# Altium schematic sheet AVR64DA64-BREAKOUT.SchDoc
size A2; SheetNumber: 1; SheetTotal: 3
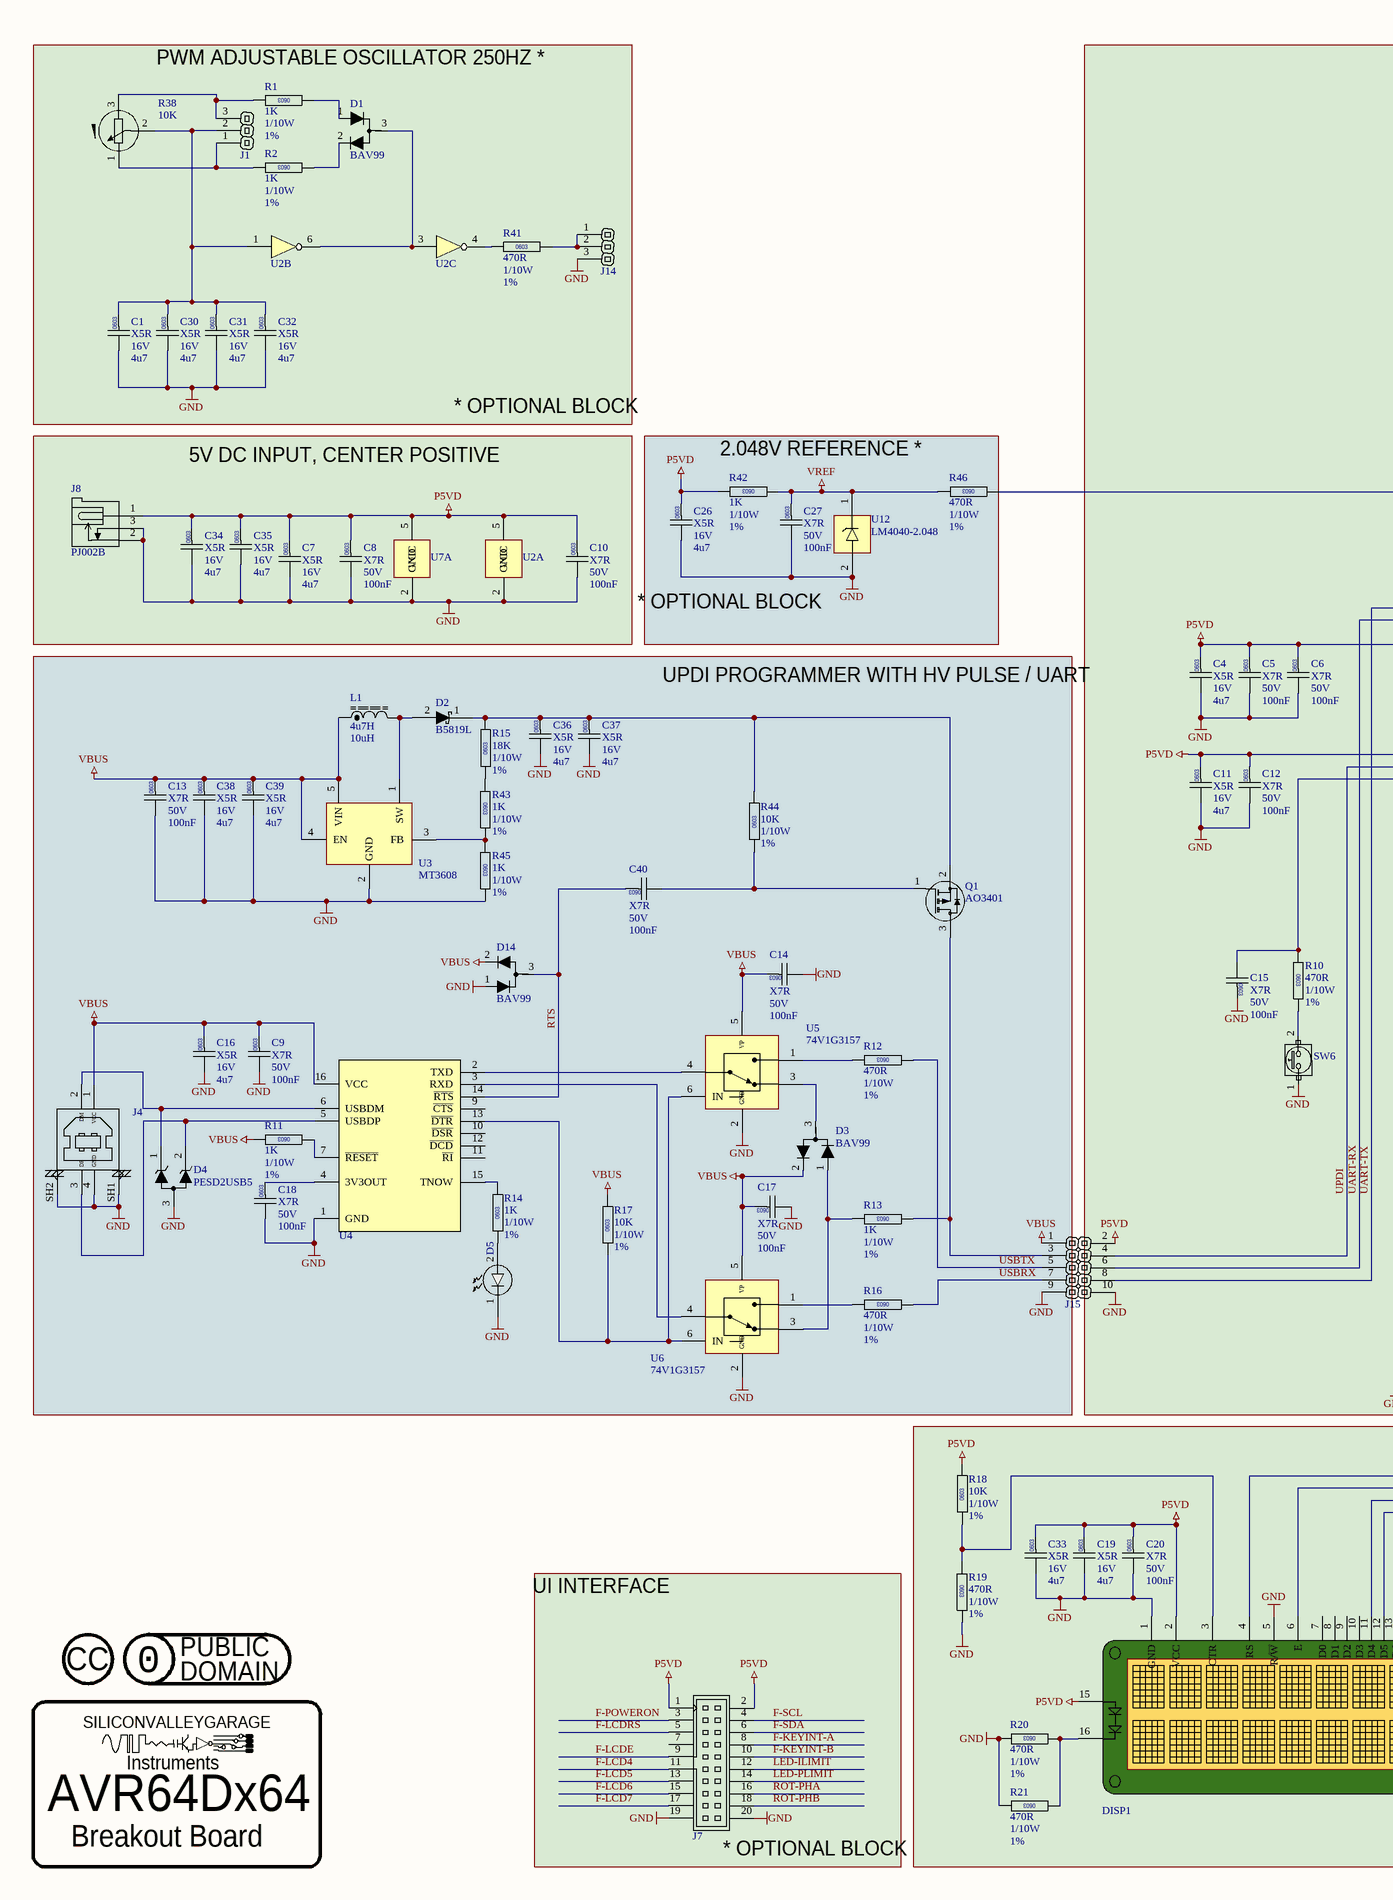
[diagram p0: AVR64DA64-BREAKOUT.SchDoc, left]
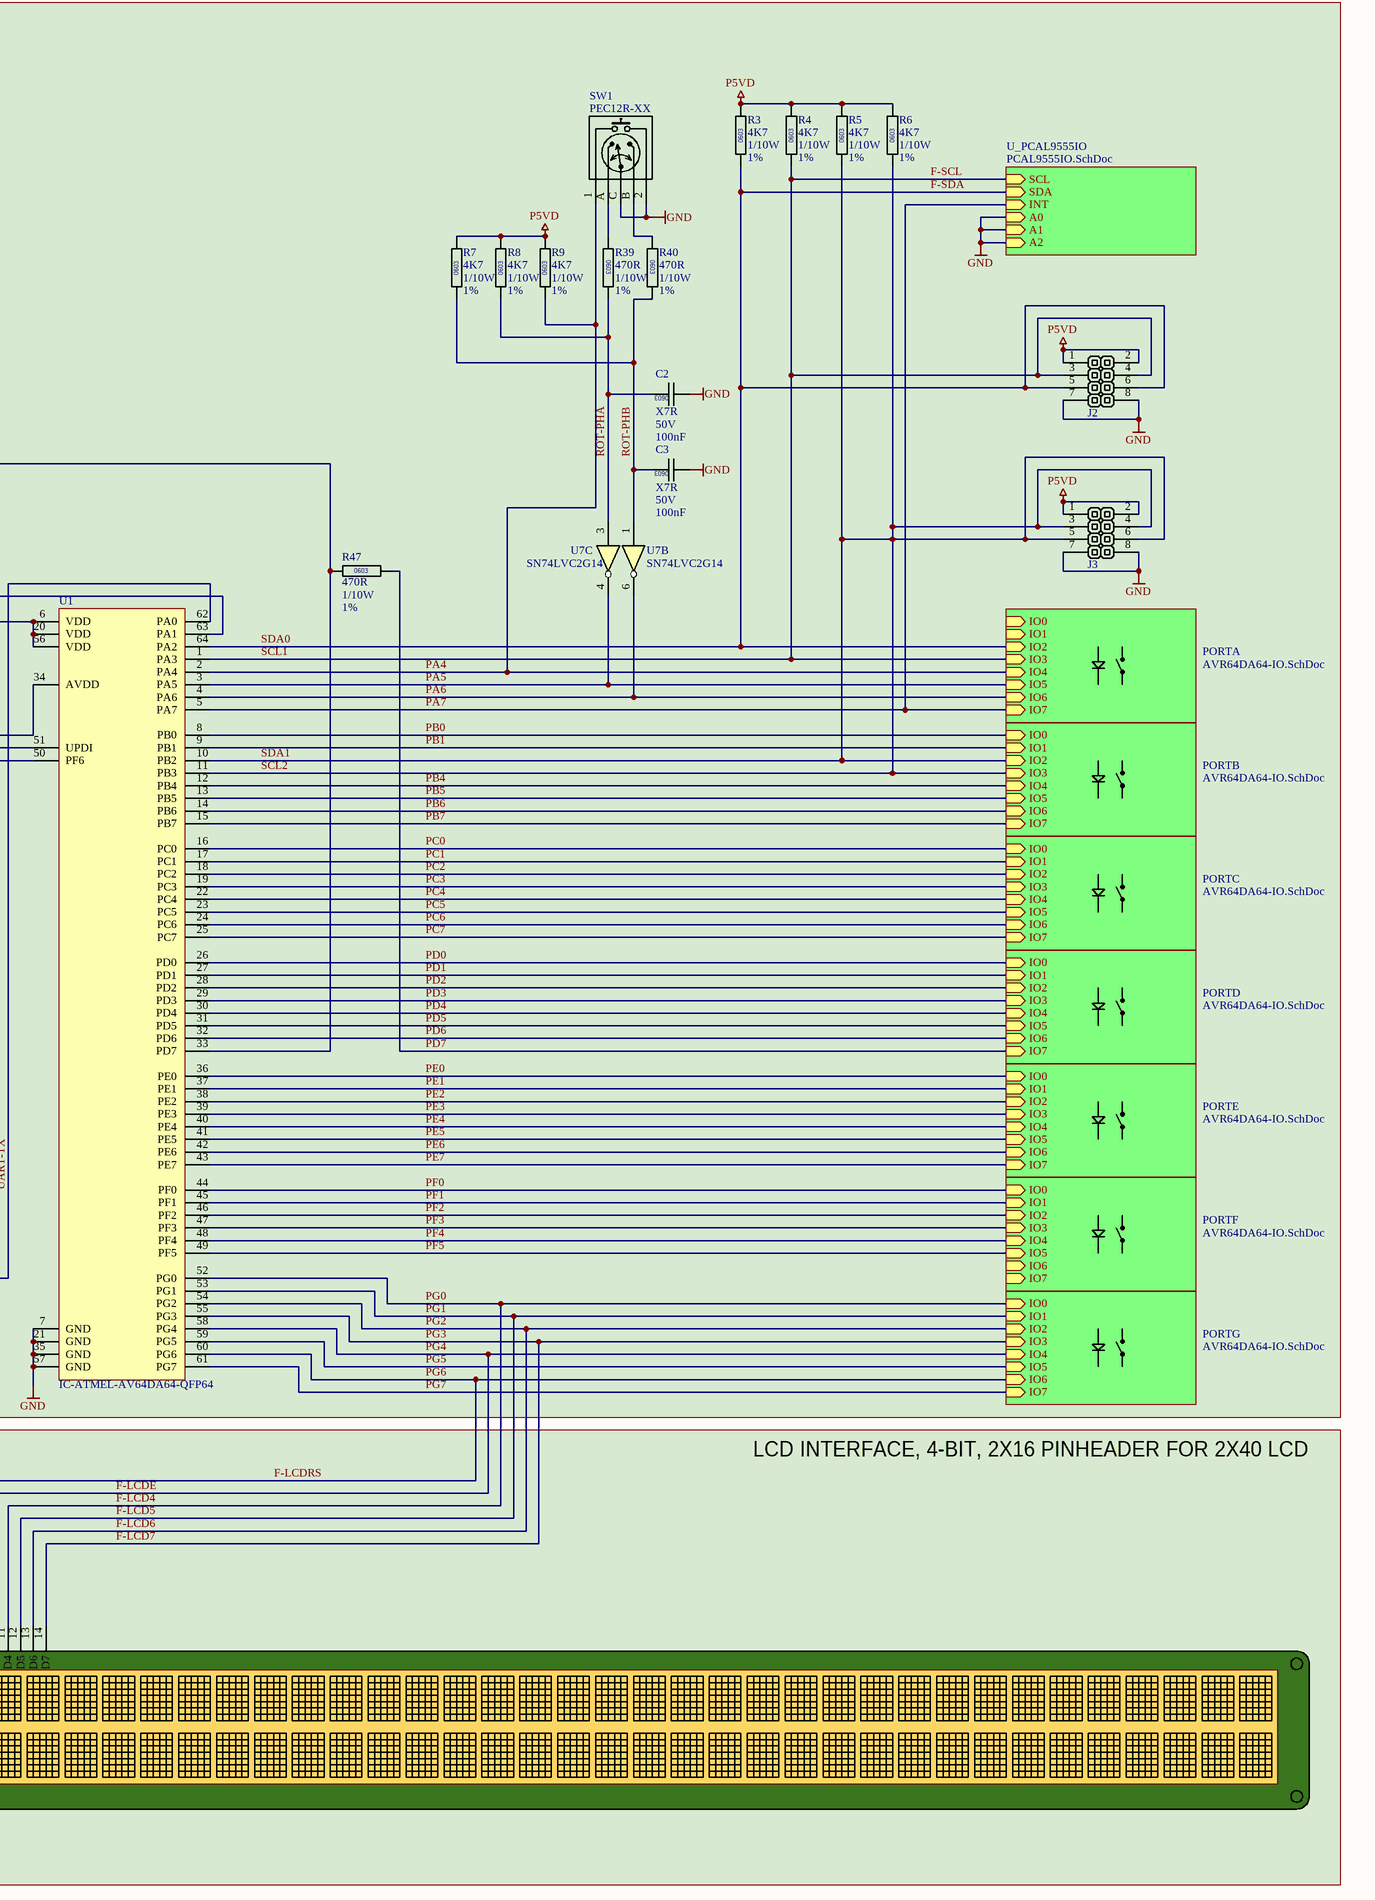
[diagram p1: AVR64DA64-BREAKOUT.SchDoc, right]

## Parts
(Parts that share a designator on the sheet are numbered #1, #2 ... from top to bottom, then left to right.)
C1  Dielectric: X5R  Voltage: 16V  Capacitance: 4u7  [CAPC0603]  (hidden comment: CAP0603)
C2  Dielectric: X7R  Voltage: 50V  Capacitance: 100nF  [CAPC0603]  (hidden comment: CAP0603)
C3  Dielectric: X7R  Voltage: 50V  Capacitance: 100nF  [CAPC0603]  (hidden comment: CAP0603)
C4  Dielectric: X5R  Voltage: 16V  Capacitance: 4u7  [CAPC0603]  (hidden comment: CAP0603)
C5  Dielectric: X7R  Voltage: 50V  Capacitance: 100nF  [CAPC0603]  (hidden comment: CAP0603)
C6  Dielectric: X7R  Voltage: 50V  Capacitance: 100nF  [CAPC0603]  (hidden comment: CAP0603)
C7  Dielectric: X5R  Voltage: 16V  Capacitance: 4u7  [CAPC0603]  (hidden comment: CAP0603)
C8  Dielectric: X7R  Voltage: 50V  Capacitance: 100nF  [CAPC0603]  (hidden comment: CAP0603)
C9  Dielectric: X7R  Voltage: 50V  Capacitance: 100nF  [CAPC0603]  (hidden comment: CAP0603)
C10  Dielectric: X7R  Voltage: 50V  Capacitance: 100nF  [CAPC0603]  (hidden comment: CAP0603)
C11  Dielectric: X5R  Voltage: 16V  Capacitance: 4u7  [CAPC0603]  (hidden comment: CAP0603)
C12  Dielectric: X7R  Voltage: 50V  Capacitance: 100nF  [CAPC0603]  (hidden comment: CAP0603)
C13  Dielectric: X7R  Voltage: 50V  Capacitance: 100nF  [CAPC0603]  (hidden comment: CAP0603)
C14  Dielectric: X7R  Voltage: 50V  Capacitance: 100nF  [CAPC0603]  (hidden comment: CAP0603)
C15  Dielectric: X7R  Voltage: 50V  Capacitance: 100nF  [CAPC0603]  (hidden comment: CAP0603)
C16  Dielectric: X5R  Voltage: 16V  Capacitance: 4u7  [CAPC0603]  (hidden comment: CAP0603)
C17  Dielectric: X7R  Voltage: 50V  Capacitance: 100nF  [CAPC0603]  (hidden comment: CAP0603)
C18  Dielectric: X7R  Voltage: 50V  Capacitance: 100nF  [CAPC0603]  (hidden comment: CAP0603)
C19  Dielectric: X5R  Voltage: 16V  Capacitance: 4u7  [CAPC0603]  (hidden comment: CAP0603)
C20  Dielectric: X7R  Voltage: 50V  Capacitance: 100nF  [CAPC0603]  (hidden comment: CAP0603)
C26  Dielectric: X5R  Voltage: 16V  Capacitance: 4u7  [CAPC0603]  (hidden comment: CAP0603)
C27  Dielectric: X7R  Voltage: 50V  Capacitance: 100nF  [CAPC0603]  (hidden comment: CAP0603)
C30  Dielectric: X5R  Voltage: 16V  Capacitance: 4u7  [CAPC0603]  (hidden comment: CAP0603)
C31  Dielectric: X5R  Voltage: 16V  Capacitance: 4u7  [CAPC0603]  (hidden comment: CAP0603)
C32  Dielectric: X5R  Voltage: 16V  Capacitance: 4u7  [CAPC0603]  (hidden comment: CAP0603)
C33  Dielectric: X5R  Voltage: 16V  Capacitance: 4u7  [CAPC0603]  (hidden comment: CAP0603)
C34  Dielectric: X5R  Voltage: 16V  Capacitance: 4u7  [CAPC0603]  (hidden comment: CAP0603)
C35  Dielectric: X5R  Voltage: 16V  Capacitance: 4u7  [CAPC0603]  (hidden comment: CAP0603)
C36  Dielectric: X5R  Voltage: 16V  Capacitance: 4u7  [CAPC0603]  (hidden comment: CAP0603)
C37  Dielectric: X5R  Voltage: 16V  Capacitance: 4u7  [CAPC0603]  (hidden comment: CAP0603)
C38  Dielectric: X5R  Voltage: 16V  Capacitance: 4u7  [CAPC0603]  (hidden comment: CAP0603)
C39  Dielectric: X5R  Voltage: 16V  Capacitance: 4u7  [CAPC0603]  (hidden comment: CAP0603)
C40  Dielectric: X7R  Voltage: 50V  Capacitance: 100nF  [CAPC0603]  (hidden comment: CAP0603)
D1  BAV99  [SOT23]
D2  B5819L  [SOD123]
D3  BAV99  [SOT23]
D4  PESD2USB5  [SOT23]
D5  KT-0603W  [LED-0603-GREEN]  (value not drawn)
D14  BAV99  [SOT23]
DISP1  DISPLAY-LCD-2X40  [CONNECTOR-GENERIC-BOXHEADER-2X8]  (value not drawn)
J1  BOXHEADER-2X4  [HEADER-GENERIC-MALE-1X3]  (value not drawn)
J2  BOXHEADER-2X4  [CONNECTOR-GENERIC-PINHEADER-2X4]  (value not drawn)
J3  BOXHEADER-2X4  [CONNECTOR-GENERIC-PINHEADER-2X4]  (value not drawn)
J4  CONN-CUI-UJ2-BH-BL1-TH  [CONN-CUI-UJ2-BH-BL1-TH]  (value not drawn)
J7  BOXHEADER-10X2  [CONNECTOR GENERIC-BOXHEADER-2X10]  (value not drawn)
J8  PJ002B  [CONN-CUI-PJ-002B]
J14  BOXHEADER-2X4  [HEADER-GENERIC-MALE-1X3]  (value not drawn)
J15  BOXHEADER-3X2  [CONNECTOR-GENERIC-PINHEADER-2X5]  (value not drawn)
L1  10uH  value 4u7H  [CAPC0603]
LOGO?#1  LOGO-LICENSE-CC  [LOGO-LICENSE-CC]  (value not drawn)  (no BOM)
LOGO?#2  LOGO-LICENSE-CC0-PUBLIC  [LOGO-LICENSE-CC0-PUBLIC]  (value not drawn)  (no BOM)
LOGO?#3  LOGO-SILICONVALLEYGARAGE-SMALL  [SILICONVALLEYGARAGE]  (value not drawn)  (graphical)
Q1  AO3401  [SOT23]
R1  value 1K  Power: 1/10W  Tolerance: 1%  [RESC0603]  (hidden comment: RESC0603)
R2  value 1K  Power: 1/10W  Tolerance: 1%  [RESC0603]  (hidden comment: RESC0603)
R3  value 4K7  Power: 1/10W  Tolerance: 1%  [RESC0603]  (hidden comment: RESC0603)
R4  value 4K7  Power: 1/10W  Tolerance: 1%  [RESC0603]  (hidden comment: RESC0603)
R5  value 4K7  Power: 1/10W  Tolerance: 1%  [RESC0603]  (hidden comment: RESC0603)
R6  value 4K7  Power: 1/10W  Tolerance: 1%  [RESC0603]  (hidden comment: RESC0603)
R7  value 4K7  Power: 1/10W  Tolerance: 1%  [RESC0603]  (hidden comment: RESC0603)
R8  value 4K7  Power: 1/10W  Tolerance: 1%  [RESC0603]  (hidden comment: RESC0603)
R9  value 4K7  Power: 1/10W  Tolerance: 1%  [RESC0603]  (hidden comment: RESC0603)
R10  value 470R  Power: 1/10W  Tolerance: 1%  [RESC0603]  (hidden comment: RESC0603)
R11  value 1K  Power: 1/10W  Tolerance: 1%  [RESC0603]  (hidden comment: RESC0603)
R12  value 470R  Power: 1/10W  Tolerance: 1%  [RESC0603]  (hidden comment: RESC0603)
R13  value 1K  Power: 1/10W  Tolerance: 1%  [RESC0603]  (hidden comment: RESC0603)
R14  value 1K  Power: 1/10W  Tolerance: 1%  [RESC0603]  (hidden comment: RESC0603)
R15  value 18K  Power: 1/10W  Tolerance: 1%  [RESC0603]  (hidden comment: RESC0603)
R16  value 470R  Power: 1/10W  Tolerance: 1%  [RESC0603]  (hidden comment: RESC0603)
R17  value 10K  Power: 1/10W  Tolerance: 1%  [RESC0603]  (hidden comment: RESC0603)
R18  value 10K  Power: 1/10W  Tolerance: 1%  [RESC0603]  (hidden comment: RESC0603)
R19  value 470R  Power: 1/10W  Tolerance: 1%  [RESC0603]  (hidden comment: RESC0603)
R20  value 470R  Power: 1/10W  Tolerance: 1%  [RESC0603]  (hidden comment: RESC0603)
R21  value 470R  Power: 1/10W  Tolerance: 1%  [RESC0603]  (hidden comment: RESC0603)
R38  value 10K  [POTMETER-PTV09A-4015F-BXXX]  (hidden comment: POTMETER-PTV09A-4015F-B103)
R39  value 470R  Power: 1/10W  Tolerance: 1%  [RESC0603]  (hidden comment: RESC0603)
R40  value 470R  Power: 1/10W  Tolerance: 1%  [RESC0603]  (hidden comment: RESC0603)
R41  value 470R  Power: 1/10W  Tolerance: 1%  [RESC0603]  (hidden comment: RESC0603)
R42  value 1K  Power: 1/10W  Tolerance: 1%  [RESC0603]  (hidden comment: RESC0603)
R43  value 1K  Power: 1/10W  Tolerance: 1%  [RESC0603]  (hidden comment: RESC0603)
R44  value 10K  Power: 1/10W  Tolerance: 1%  [RESC0603]  (hidden comment: RESC0603)
R45  value 1K  Power: 1/10W  Tolerance: 1%  [RESC0603]  (hidden comment: RESC0603)
R46  value 470R  Power: 1/10W  Tolerance: 1%  [RESC0603]  (hidden comment: RESC0603)
R47  value 470R  Power: 1/10W  Tolerance: 1%  [RESC0603]  (hidden comment: RESC0603)
SW1  PEC12R-XX  [SWITCH-BOURNS-PEC12R-4120F-S0012]
SW6  SWITCH-XUNPU-TS-1088-AR02016  [SWITCH-XUNPU-TS-1088-AR02016]  (value not drawn)
U1  IC-ATMEL-AV64DA64-QFP64  [QFP50P1000X1000X100-64N]
U2  IC-TI-SN74LVC2G14  [SOT23-6]  (value not drawn)  (parts A,B,C of 3)
U3  MT3608  [SOT23-6]
U4  CP2102  [SO127P600-16N]  (value not drawn)
U5  74V1G3157  [SOT23-6]
U6  74V1G3157  [SOT23-6]
U7  IC-TI-SN74LVC2G14  [SOT23-6]  (value not drawn)  (parts A,B,C of 3)
U12  LM4040-2.048  [SOT23]

## Blocks framed on the sheet
5V DC INPUT, CENTER POSITIVE: C7 C8 C10 C34 C35 J8 U2 U7
UPDI PROGRAMMER WITH HV PULSE / UART: C9 C13 C14 C16-C18 C36-C40 D2-D5 D14 J4 L1 Q1 R11-R17 R43-R45 U3-U6
LCD INTERFACE, 4-BIT, 2X16 PINHEADER FOR 2X40 LCD: C19 C20 C33 DISP1 R18-R21
AVR64Dx64: LOGO?#3

## Sub-sheets
PORTA = AVR64DA64-IO.SchDoc: IO0 (in), IO1 (in), IO2 (in), IO3 (in), IO4 (in), IO5 (in), IO6 (in), IO7 (in)
PORTB = AVR64DA64-IO.SchDoc: IO0 (in), IO1 (in), IO2 (in), IO3 (in), IO4 (in), IO5 (in), IO6 (in), IO7 (in)
PORTC = AVR64DA64-IO.SchDoc: IO0 (in), IO1 (in), IO2 (in), IO3 (in), IO4 (in), IO5 (in), IO6 (in), IO7 (in)
PORTD = AVR64DA64-IO.SchDoc: IO0 (in), IO1 (in), IO2 (in), IO3 (in), IO4 (in), IO5 (in), IO6 (in), IO7 (in)
PORTE = AVR64DA64-IO.SchDoc: IO0 (in), IO1 (in), IO2 (in), IO3 (in), IO4 (in), IO5 (in), IO6 (in), IO7 (in)
PORTF = AVR64DA64-IO.SchDoc: IO0 (in), IO1 (in), IO2 (in), IO3 (in), IO4 (in), IO5 (in), IO6 (in), IO7 (in)
PORTG = AVR64DA64-IO.SchDoc: IO0 (in), IO1 (in), IO2 (in), IO3 (in), IO4 (in), IO5 (in), IO6 (in), IO7 (in)
U_PCAL9555IO = PCAL9555IO.SchDoc: SCL (in), SDA (in), INT (in), A0 (in), A1 (in), A2 (in)

## Nets
GND: C1.2 C2.2 C3.2 C4.2 C5.2 C6.2 C7.2 C8.2 C9.2 C10.2 C11.2 C12.2 C13.2 C14.2 C15.1 C16.2 C17.2 C18.2 C19.2 C20.2 C26.2 C27.2 C30.2 C31.2 C32.2 C33.2 C34.2 C35.2 C36.2 C37.2 C38.2 C39.2 D4.3(A) D5.1(A) D14.1(K) DISP1.1(GND) DISP1.5(R/~{W}) J2.7(-) J2.8(-) J3.7(-) J3.8(-) J4.4(GND) J4.SH1(NO) J4.SH2(NO) J7.19(-) J7.20(-) J8.2 J8.3 J14.3(-) J15.9(-) J15.10(-) R19.1 R20.1 R21.1 R45.1 SW1.2 SW1.C SW6.1 U1.7(GND) U1.21(GND) U1.35(GND) U1.57(GND) U2.2(GND) U3.2(GND) U4.1(GND) U5.2(GND) U6.2(GND) U7.2(GND) U12.2 ; sheet U_PCAL9555IO/A0, sheet U_PCAL9555IO/A1, sheet U_PCAL9555IO/A2
P5VD: C4.1 C5.1 C6.1 C7.1 C8.1 C10.1 C11.1 C12.1 C19.1 C20.1 C26.1 C33.1 C34.1 C35.1 DISP1.2(VCC) DISP1.15(LED+) J2.1(+) J2.2(-) J3.1(+) J3.2(-) J7.1(+) J7.2(-) J8.1 J15.2(-) R3.1 R4.1 R5.1 R6.1 R7.1 R8.1 R9.1 R18.1 R42.1 U1.6(VDD) U1.20(VDD) U1.34(AVDD) U1.56(VDD) U2.5(VCC) U7.5(VCC)
VBUS: C9.1 C13.1 C14.1 C16.1 C17.1 C38.1 C39.1 D3.2(A) D14.2(A) J4.1(VCC) J15.1(+) L1.1 R11.1 R17.1 U3.4(EN) U3.5(VIN) U4.16(VCC) U5.5(VP) U6.5(VP)
VREF: C27.1 R42.2 R46.1 U12.1
F-KEYINT-A: J7.8(-)
F-KEYINT-B: J7.10(-)
F-LCD4: DISP1.11(D4) J7.11(-) U1.52(PG0) ; sheet PORTG/IO0  [also labelled PG0]
F-LCD5: DISP1.12(D5) J7.13(-) U1.53(PG1) ; sheet PORTG/IO1  [also labelled PG1]
F-LCD6: DISP1.13(D6) J7.15(-) U1.54(PG2) ; sheet PORTG/IO2  [also labelled PG2]
F-LCD7: DISP1.14(D7) J7.17(-) U1.55(PG3) ; sheet PORTG/IO3  [also labelled PG3]
F-LCDE: DISP1.6(E) J7.9(-) U1.58(PG4) ; sheet PORTG/IO4  [also labelled PG4]
F-LCDRS: DISP1.4(RS) J7.5(-) U1.60(PG6) ; sheet PORTG/IO6  [also labelled PG6]
F-POWERON: J7.3(-)
F-SCL: J2.3(-) J2.4(-) J7.4(-) R4.2 U1.1(PA3) ; sheet PORTA/IO3, sheet U_PCAL9555IO/SCL  [also labelled SCL1]
F-SDA: J2.5(-) J2.6(-) J7.6(-) R3.2 U1.64(PA2) ; sheet PORTA/IO2, sheet U_PCAL9555IO/SDA  [also labelled SDA0]
LED-ILIMIT: J7.12(-)
LED-PLIMIT: J7.14(-)
PA4: R9.2 SW1.1 U1.2(PA4) ; sheet PORTA/IO4
PA5: U1.3(PA5) U7.4 ; sheet PORTA/IO5
PA6: U1.4(PA6) U7.6 ; sheet PORTA/IO6
PA7: U1.5(PA7) ; sheet PORTA/IO7, sheet U_PCAL9555IO/INT
PB0: U1.8(PB0) ; sheet PORTB/IO0
PB1: U1.9(PB1) ; sheet PORTB/IO1
PB4: U1.12(PB4) ; sheet PORTB/IO4
PB5: U1.13(PB5) ; sheet PORTB/IO5
PB6: U1.14(PB6) ; sheet PORTB/IO6
PB7: U1.15(PB7) ; sheet PORTB/IO7
PC0: U1.16(PC0) ; sheet PORTC/IO0
PC1: U1.17(PC1) ; sheet PORTC/IO1
PC2: U1.18(PC2) ; sheet PORTC/IO2
PC3: U1.19(PC3) ; sheet PORTC/IO3
PC4: U1.22(PC4) ; sheet PORTC/IO4
PC5: U1.23(PC5) ; sheet PORTC/IO5
PC6: U1.24(PC6) ; sheet PORTC/IO6
PC7: U1.25(PC7) ; sheet PORTC/IO7
PD0: U1.26(PD0) ; sheet PORTD/IO0
PD1: U1.27(PD1) ; sheet PORTD/IO1
PD2: U1.28(PD2) ; sheet PORTD/IO2
PD3: U1.29(PD3) ; sheet PORTD/IO3
PD4: U1.30(PD4) ; sheet PORTD/IO4
PD5: U1.31(PD5) ; sheet PORTD/IO5
PD6: U1.32(PD6) ; sheet PORTD/IO6
PD7: R47.1 ; sheet PORTD/IO7
PE0: U1.36(PE0) ; sheet PORTE/IO0
PE1: U1.37(PE1) ; sheet PORTE/IO1
PE2: U1.38(PE2) ; sheet PORTE/IO2
PE3: U1.39(PE3) ; sheet PORTE/IO3
PE4: U1.40(PE4) ; sheet PORTE/IO4
PE5: U1.41(PE5) ; sheet PORTE/IO5
PE6: U1.42(PE6) ; sheet PORTE/IO6
PE7: U1.43(PE7) ; sheet PORTE/IO7
PF0: U1.44(PF0) ; sheet PORTF/IO0
PF1: U1.45(PF1) ; sheet PORTF/IO1
PF2: U1.46(PF2) ; sheet PORTF/IO2
PF3: U1.47(PF3) ; sheet PORTF/IO3
PF4: U1.48(PF4) ; sheet PORTF/IO4
PF5: U1.49(PF5) ; sheet PORTF/IO5
PG5: U1.59(PG5) ; sheet PORTG/IO5
PG7: U1.61(PG7) ; sheet PORTG/IO7
ROT-PHA: C2.1 J7.16(-) R8.2 R39.1 U7.3
ROT-PHB: C3.1 J7.18(-) R7.2 R40.1 U7.1
RTS: C40.1 D14.3(A) U4.14(~{RTS})
SCL2: J3.3(-) J3.4(-) J3.5(-) J3.6(-) R5.2 R6.2 U1.10(PB2) U1.11(PB3) ; sheet PORTB/IO2, sheet PORTB/IO3  [also labelled SDA1]
UART-RX: J15.6(-) U1.63(PA1)
UART-TX: J15.8(-) U1.62(PA0)
UPDI: J15.4(-) U1.51(UPDI)
USBRX: J15.7(-) R16.2
USBTX: J15.5(-) R12.2
NetC1_1: C1.1 C30.1 C31.1 C32.1 J1.2(-) R38.2 U2.1
NetC15_2: C15.2 R10.2 U1.50(PF6)
NetC18_1: C18.1 U4.4(3V3OUT)
NetC36_1: C36.1 C37.1 D2.1(A) Q1.2(S) R15.1 R44.1
NetC40_2: C40.2 Q1.1(G1) R44.2
NetD1_1: D1.1(K) R1.2
NetD1_2: D1.2(A) R2.2
NetD1_3: D1.3(A) U2.3 U2.6
NetD2_2: D2.2(K) L1.2 U3.1(SW)
NetD3_1: D3.1(K) R13.1 U6.3(B1)
NetD3_3: D3.3(A) U5.3(B1)
NetD4_1: D4.1(K) J4.2(DM) U4.6(USBDM)
NetD4_2: D4.2(A) J4.3(DP) U4.5(USBDP)
NetD5_2: D5.2(K) R14.2
NetDISP1_3: DISP1.3(CTR) R18.2 R19.2
NetDISP1_16: DISP1.16(LED-) R20.2 R21.2
NetJ1_1: J1.1(+) R2.1 R38.1
NetJ1_3: J1.3(-) R1.1 R38.3
NetJ14_1: J14.1(+) J14.2(-) R41.1
NetJ15_3: J15.3(-) Q1.3(D) R13.2
NetR10_1: R10.1 SW6.2
NetR11_2: R11.2 U4.7(~{RESET})
NetR12_1: R12.1 U5.1(NO)
NetR14_1: R14.1 U4.15(TNOW)
NetR15_2: R15.2 R43.2
NetR16_1: R16.1 U6.1(NO)
NetR17_2: R17.2 U4.13(~{DTR}) U5.6(IN) U6.6(IN)
NetR39_2: R39.2 SW1.A
NetR40_2: R40.2 SW1.B
NetR41_2: R41.2 U2.4
NetR43_1: R43.1 R45.2 U3.3(FB)
NetR46_2: R46.2 R47.2 U1.33(PD7)
NetU4_2: U4.2(TXD) U5.4(COM)
NetU4_3: U4.3(RXD) U6.4(COM)

Not connected (* = marked no-connect by the designer): DISP1 7(D0) 8(D1) 9(D2) 10(D3); J7 7(-); U4 9(~{CTS}) 10(~{DSR}) 11(~{RI}) 12(~{DCD})

## Notes on the sheet
- PWM ADJUSTABLE OSCILLATOR 250HZ *
- * OPTIONAL BLOCK
- 2.048V REFERENCE *
- UI INTERFACE
- (near LOGO?#3) Instruments
- Breakout Board
- (near J7) * OPTIONAL BLOCK
- (in symbol LOGO-LICENSE-CC) CC
- (in symbol LOGO-LICENSE-CC0-PUBLIC) PUBLIC; 0; DOMAIN
- (in symbol LOGO-SILICONVALLEYGARAGE-SMALL) SILICONVALLEYGARAGE
- (in symbol RESC-0603-1K-1%-1/10W) 0603
- (in symbol RESC-0603-4K7-1%-1/10W) 0603
- (in symbol RESC-0603-10K-1%-1/10W) 0603
- (in symbol RESC-0603-18K-1%-1/10W) 0603
- (in symbol RESC-0603-470R-1%-1/10W) 0603

## Library data of the parts
C1 C4 C7 C11 C16 C19 C26 C30-C39 = CAPC-0603-4u7-10V-X5R_1: CAPACITOR,CERAMIC,4u7,16V,X5R,0603; Package / Case: 0603; Location: *; LCSC: C19666
C2 C3 C5 C6 C8-C10 C12-C15 C17 C18 C20 C27 C40 = CAPC-0603-100nF-50V-X7R: CAPACITOR,CERAMIC,100nF,50V,X7R,0603; Manufacturer 1: KEMET; Manufacturer Part Number 1: C0603C104K5RACTU; Package / Case: 0603; Location: *; LCSC: C14663; MOUSER: 80-C0603C104K5R
D1 D3 D14 = DIODE-DIODES-BAV99: DIODE,75V,215mA,SOT23,LOW LEAKAGE; LCSC: C2500
D2 = DIODE-SCHOTTKY-ONSEMI-B5819L: DIODE,SCHOTTKY,40V,1,B5819,SOD123; Manufacturer 1: JIANGSU CHANGJING; Manufacturer Part Number 1: B5819W SL; LCSC: C8598
D4 = TVS-NEXPERIA-PESD2USB5UX-TR: DIODE,TVS,DUAL,NIDIRETIONAL,USB,PESD2USB5UX-TR,SOT23; DIGIKEY: 1727-PESD2USB5UX-CT-ND; LCSC: C3709087; Manufacturer 1: NEXPERIA; Manufacturer Part Number 1: PESD2USB5UX-TR
D5 = LED-0603-WHITE: LED,SMD,WHITE,42mCd,0603; Manufacturer 1: Hubei KENTO Elec; LCSC: C2290; Manufacturer Part Number 1: KT-0603W
DISP1 = DISPLAY-LCD-2X40: DISPLAY,LCD,ALPHA,2X40CHAR,HD44780,YELLOW BL; LCSC: C429960
J1 J14 = CONN-HEADER-MALE-1x3: CONN,HEADER,1x3,2.54mm; LCSC: C429954
J2 J3 = CONN-HEADER-MALE-2X4: CONN,HEADER,2X4,2.54mm; LCSC: C42431809
J4 = CONN-CUI-UJ2-BH-BL1-TH: CONN,USB2.0,B,RA,BLUE; LCSC: C720549
J7 = CONN-BOXHEADER-10X2: LCSC: C429961
J8 = CONN-CUI-PJ002B: CONN,DCPOWER,BARREL,CUI,PJ002B
J15 = CONN-HEADER-MALE-2X5: CONN,HEADER,2X5,2.54mm; LCSC: C42431802
L1 = IND-MURATA-LQM18PN4R7MFRL: IND,4u7H,0.6A,0603, LLQM18PN4R7MFRL; Manufacturer 1: MURATA; LCSC: C114862; Manufacturer Part Number 1: LLQM18PN4R7MFRL; MOUSER: 81-LQH3NPZ100MMEL
LOGO?#3 = LOGO-SILICONVALLEYGARAGE-SMALL: LOGO,SILICONVALLEYGARAGE,SMALL
Q1 = XSTR-PMOS-ALPHAOMEGA-AO3401: XSTR,PMOS,30V,4A,AO3401,SOT23; Manufacturer Part Number 1: AO3401A; Package: DPAK; Vds: 30V; Idmax: 4A; LCSC: C15127; Manufacturer 1: ALPHA OMEGA
R1 R2 R11 R13 R14 R42 R43 R45 = RESC-0603-1K-1%-1/10W: RESISTOR,1K,1%,100mW,0603 (1608); Manufacturer 1: YAGEO; Manufacturer Part Number 1: RC0603FR-071KL; Location: *; LCSC: C21190; MOUSER: 603-RC0603FR-071KL
R3-R9 = RESC-0603-4K7-1%-1/10W: RESISTOR,4K7,1%,100mW,0603 (1608); Manufacturer 1: YAGEO; Manufacturer Part Number 1: RC0603FR-074K7L; Location: *; LCSC: C23162; MOUSER: 603-RC0603FR-074K7L
R10 R12 R16 R19-R21 R39-R41 R46 R47 = RESC-0603-470R-1%-1/10W: RESISTOR,470R,1%,100mW,0603 (1608); Location: *; LCSC: C23179
R15 = RESC-0603-18K-1%-1/10W: RESISTOR,18K,1%,100mW,0603 (1608); Location: *; LCSC: C25810
R17 R18 R44 = RESC-0603-10K-1%-1/10W: RESISTOR,10K,1%,100mW,0603 (1608); Manufacturer 1: YAGEO; Manufacturer Part Number 1: RC0603FR-0710KL; Location: *; LCSC: C25804; MOUSER: 603-RC0603FR-0710KL
R38 = POTMETER-PTV09A-4015F-B103: RES,POT,VERT,TH,BOURNS PTV09A-4015F,10K
SW1 = SWITCH-BOURNS-PEC12R-4120F-S0012: SWITCH,ENCODER+CLICK,BOURNS,PEC12R-4120F-S0012; Manufacturer 1: BOURNS; Manufacturer Part Number 1: PEC12R-4120F-S0012
SW6 = SWITCH-XUNPU-TS-1088-AR02016: SWITCH,TACT,SMD,2PIN,SMT,TOP ACTUATOR; Manufacturer 1: XUNPU; LCSC: C720477; Manufacturer Part Number 1: TS-1088-AR02016
U1 = IC-ATMEL-AV64DA64-QFP64: IC,CPU,ATMEL,AVR64DA64,TQFP64; LCSC: C5227841
U2 U7 = IC-TI-SN74LVC2G14: IC,LOGIC,SINGLEGATE,DUAL SCHMITT-TRIGER,INVERTER,SOT23-6; Manufacturer Part Number 1: 74LVC2G14GV; LCSC: C19829598
U3 = IC-AEROSEMI-MT3608: IC,REG,BOOST,AEROSEMI,MT3608; LCSC: C84817
U4 = IC-WCH-CH340B: IC,XCVR,USB UART WITH XTAL AND EEPROM,WCH,CH340G-SO16; Manufacturer Part Number 1: FT231XS-R; LCSC: CH340B; Manufacturer 1: WCH; MOUSER: CH340B
U5 U6 = IC-TI-SN74LVC1G3157DBVR: IC,ANALOG,SPDT ANALOG SWITCH,SINGLEGATE,TI,SN74LVC1G3157DBVR,SOT23-6; LCSC: C2673494; DIGIKEY: 296-14908-1-ND; Manufacturer 1: TI; Manufacturer Part Number 1: SN74LVC1G3157DBVR
U12 = IC-TI-LM4040-2.048: IC,VOLTAGE REFERENCE,2.048V; Manufacturer 1: TI; Manufacturer Part Number 1: LM4040A20IDBZR; LCSC: C2156884